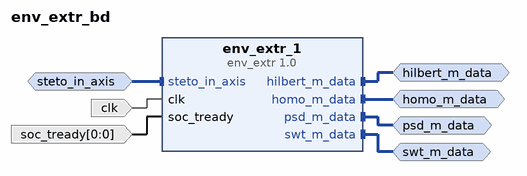
[diagram p0: block diagram of the top level]
# Vivado block design env_extr_bd, xck26-sfvc784-2LV-c, Vivado 2023.2.2
create_bd_design env_extr_bd

create_bd_intf_port -mode Master -vlnv xilinx.com:interface:axis_rtl:1.0 hilbert_m_data
create_bd_intf_port -mode Master -vlnv xilinx.com:interface:axis_rtl:1.0 homo_m_data
create_bd_intf_port -mode Master -vlnv xilinx.com:interface:axis_rtl:1.0 psd_m_data
create_bd_intf_port -mode Slave -vlnv xilinx.com:interface:axis_rtl:1.0 steto_in_axis
set_property -dict [list \
  CONFIG.HAS_TKEEP 0 \
  CONFIG.HAS_TLAST 0 \
  CONFIG.HAS_TREADY 1 \
  CONFIG.HAS_TSTRB 0 \
  CONFIG.LAYERED_METADATA {['xilinx.com:interface:datatypes:1.0 {', 'TDATA {datatype {name {attribs {resolve_type immediate dependency {} format string minimum {} maximum {}} value {}} bitwidth {attribs {resolve_type immediate dependency {} format long minimum {}', 'maximum {}} value 16} bitoffset {attribs {resolve_type immediate dependency {} format long minimum {} maximum {}} value 0} real {fixed {fractwidth {attribs {resolve_type immediate dependency {} format', 'long minimum {} maximum {}} value 15} signed {attribs {resolve_type immediate dependency {} format bool minimum {} maximum {}} value true}}}}}', '}']} \
  CONFIG.TDATA_NUM_BYTES 2 \
  CONFIG.TDEST_WIDTH 0 \
  CONFIG.TID_WIDTH 0 \
  CONFIG.TUSER_WIDTH 0 \
] [get_bd_intf_ports steto_in_axis]
create_bd_intf_port -mode Master -vlnv xilinx.com:interface:axis_rtl:1.0 swt_m_data
create_bd_port -dir I -type clk clk
create_bd_port -dir I -from 0 -to 0 -type data soc_tready

create_bd_cell -type ip -vlnv User_Company:VMC:env_extr:1.0 env_extr_1

# ---- connections ----

connect_bd_intf_net [get_bd_intf_pins env_extr_1/hilbert_m_data] [get_bd_intf_ports hilbert_m_data]
connect_bd_intf_net [get_bd_intf_pins env_extr_1/homo_m_data] [get_bd_intf_ports homo_m_data]
connect_bd_intf_net [get_bd_intf_pins env_extr_1/psd_m_data] [get_bd_intf_ports psd_m_data]
connect_bd_intf_net [get_bd_intf_pins env_extr_1/swt_m_data] [get_bd_intf_ports swt_m_data]
connect_bd_intf_net [get_bd_intf_pins env_extr_1/steto_in_axis] [get_bd_intf_ports steto_in_axis]
connect_bd_net [get_bd_ports clk] [get_bd_pins env_extr_1/clk]
connect_bd_net [get_bd_ports soc_tready] [get_bd_pins env_extr_1/soc_tready]

validate_bd_design
save_bd_design
